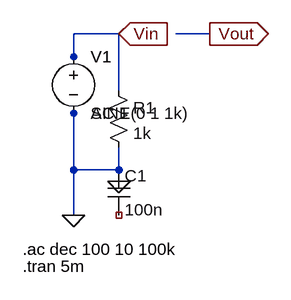
[diagram p0: schematic rc_filter_ltspice.asc]
rc_filter_ltspice.asc, the LTspice schematic file:
Version 4
SHEET 1 880 680
WIRE 272 80 208 80
WIRE 400 80 352 80
WIRE 208 112 208 80
WIRE 272 160 272 80
WIRE 272 272 272 240
WIRE 208 272 208 192
WIRE 208 272 272 272
WIRE 272 272 272 288
WIRE 208 336 208 272
FLAG 272 80 Vin
IOPIN 272 80 In
FLAG 400 80 Vout
IOPIN 400 80 Out
FLAG 272 288 0
FLAG 208 336 0
SYMBOL res 256 144 R0
SYMATTR InstName R1
SYMATTR Value 1k
SYMBOL cap 256 272 R0
SYMATTR InstName C1
SYMATTR Value 100n
SYMBOL voltage 208 96 R0
SYMATTR InstName V1
SYMATTR Value SINE(0 1 1k)
SYMBOL voltage 208 96 R0
WINDOW 123 0 0 Left 0
WINDOW 39 0 0 Left 0
SYMATTR InstName V1
SYMATTR Value AC 1
TEXT 136 384 Left 2 !.ac dec 100 10 100k
TEXT 136 408 Left 2 !.tran 5m

The netlist it stands for:
* rc_filter_ltspice.asc
R1 Vin 0 1k
C1 0 NC_01 100n
V1 Vin 0 SINE(0 1 1k)
V1 Vin 0 AC 1
.ac dec 100 10 100k
.tran 5m
.backanno
.end